# EAGLE design wireless_power_meter (EAGLE 6.1)
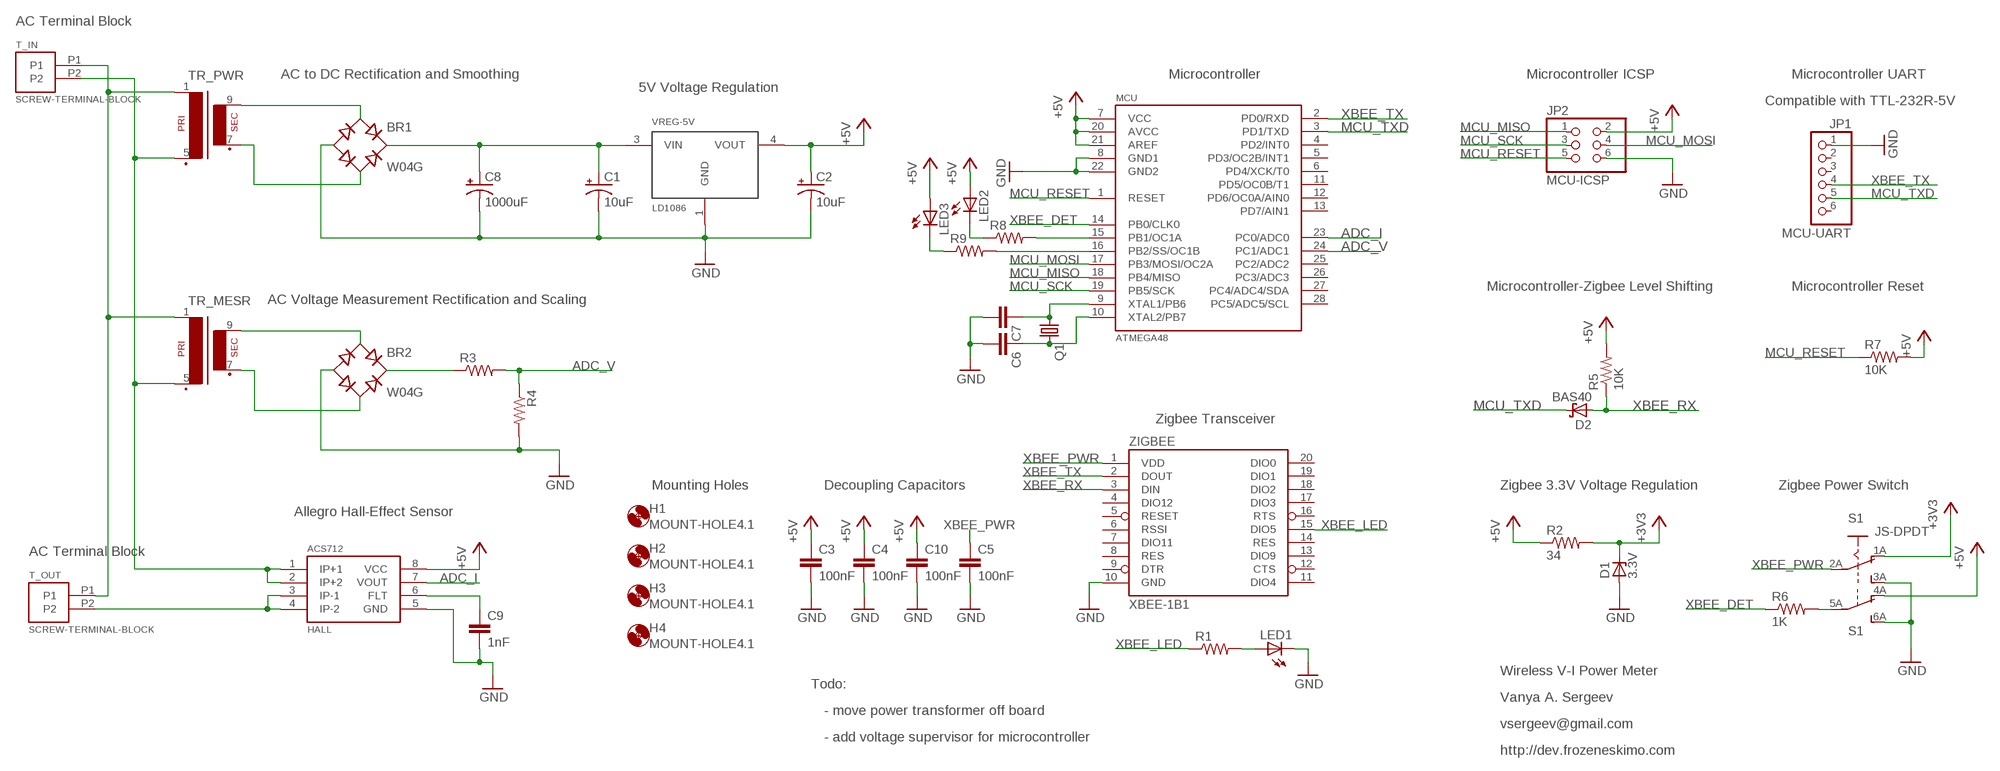
[diagram p0: schematic, sheet 1]

## Parts
BR1  W04G  [WOG]
BR2  W04G  [WOG]
C1  10uF  CPOL-USE2.5-5  [E2,5-5]
C2  10uF  CPOL-USE2.5-5  [E2,5-5]
C3  100nF  C-EUC0805  [C0805]
C4  100nF  C-EUC0805  [C0805]
C5  100nF  C-EUC0805  [C0805]
C6  C-EUC0805  [C0805]
C7  C-EUC0805  [C0805]
C8  1000uF  CPOL-USE5-13  [E5-13]
C9  1nF  C-EUC0805  [C0805]
C10  100nF  C-EUC0805  [C0805]
D1  3.3V  ZENER-DIODESOT23  [SOT23]
D2  BAS40  [SOT23]
H1  MOUNT-HOLE4.1  [4,1]
H2  MOUNT-HOLE4.1  [4,1]
H3  MOUNT-HOLE4.1  [4,1]
H4  MOUNT-HOLE4.1  [4,1]
HALL  ACS712  [SO8]
JP1  MCU-UART  PINHD-1X6  [1X06]
JP2  MCU-ICSP  PINHD-2X3  [2X03]
LED1  LEDCHIPLED_0805  [CHIPLED_0805]
LED2  LEDCHIPLED_0805  [CHIPLED_0805]
LED3  LEDCHIPLED_0805  [CHIPLED_0805]
MCU  ATMEGA48  [DIL28-3]
Q1  CRYSTALTC26H  [TC26H]
R1  R-US_R0805  [R0805]
R2  34  R-US_R0805  [R0805]
R3  R-US_R0805  [R0805]
R4  R-US_R0805  [R0805]
R5  10K  R-US_R0805  [R0805]
R6  1K  R-US_R0805  [R0805]
R7  10K  R-US_R0805  [R0805]
R8  R-US_R0805  [R0805]
R9  R-US_R0805  [R0805]
S1  JS-DPDT  [JS-MINI-SLIDE]
T_IN  SCREW-TERMINAL-BLOCK  [TERMINAL-BLOCK]
T_OUT  SCREW-TERMINAL-BLOCK  [TERMINAL-BLOCK]
TR_MESR  EI30-1  [EI30-1]
TR_PWR  EI30-1  [EI30-1]
VREG-5V  LD1086  [DPACK]
ZIGBEE  XBEE-1B1  [XBEE-1]

## Nets
+3V3: D1.3(C) R2.2 S1.1A(SW_UPPER:O)
+5V: C2.+ C3.1 C4.1 C10.1 HALL.8(VCC) JP2.2 LED2.A LED3.A MCU.7(VCC) MCU.20(AVCC) MCU.21(AREF) R2.1 R5.2 R7.2 S1.4A(SW_LOWER:O) VREG-5V.4(VOUT)
ADC_I: HALL.7(VOUT) MCU.23(PC0/ADC0)
ADC_V: MCU.24(PC1/ADC1) R3.2 R4.1
DC+: BR1.+ C1.+ C8.+ VREG-5V.3(VIN)
GND: BR1.- BR2.- C1.- C2.- C3.2 C4.2 C5.2 C6.2 C7.2 C8.- C9.2 C10.2 D1.1(A) HALL.5(GND) JP1.1 JP2.6 LED1.C MCU.8(GND1) MCU.22(GND2) R4.2 S1.3A(SW_UPPER:S) S1.6A(SW_LOWER:S) VREG-5V.1(GND) ZIGBEE.10(GND)
MCU_MISO: JP2.1 MCU.18(PB4/MISO)
MCU_MOSI: JP2.4 MCU.17(PB3/MOSI/OC2A)
MCU_RESET: JP2.5 MCU.1(RESET) R7.1
MCU_SCK: JP2.3 MCU.19(PB5/SCK)
MCU_TXD: D2.3(C) JP1.5 MCU.3(PD1/TXD)
N$2: BR1.AC1 TR_PWR.9(S4)
N$3: BR1.AC2 TR_PWR.7(S3)
N$4: C6.1 MCU.10(XTAL2/PB7) Q1.2
N$5: HALL.3(IP-1) HALL.4(IP-2) T_OUT.P2
N$6: BR2.AC1 TR_MESR.9(S4)
N$7: BR2.AC2 TR_MESR.7(S3)
N$9: BR2.+ R3.1
N$10: C9.1 HALL.6(FLT)
N$11: LED1.A R1.2
N$12: R6.2 S1.5A(SW_LOWER:P)
N$13: LED2.C R8.1
N$14: MCU.15(PB1/OC1A) R8.2
N$15: C7.1 MCU.9(XTAL1/PB6) Q1.1
N$16: MCU.16(PB2/SS/OC1B) R9.2
N$17: LED3.C R9.1
N$18: T_IN.P1 T_OUT.P1 TR_MESR.1 TR_PWR.1
N$20: HALL.1(IP+1) HALL.2(IP+2) T_IN.P2 TR_MESR.5(P2) TR_PWR.5(P2)
XBEE_DET: MCU.14(PB0/CLK0) R6.1
XBEE_LED: R1.1 ZIGBEE.15(DIO5)
XBEE_PWR: C5.1 S1.2A(SW_UPPER:P) ZIGBEE.1(VDD)
XBEE_RX: D2.1(A) R5.1 ZIGBEE.3(DIN)
XBEE_TX: JP1.4 MCU.2(PD0/RXD) ZIGBEE.2(DOUT)
Unconnected: JP1.2 JP1.3 JP1.6 MCU.4(PD2/INT0) MCU.5(PD3/OC2B/INT1) MCU.6(PD4/XCK/T0) MCU.11(PD5/OC0B/T1) MCU.12(PD6/OC0A/AIN0) MCU.13(PD7/AIN1) MCU.25(PC2/ADC2) MCU.26(PC3/ADC3) MCU.27(PC4/ADC4/SDA) MCU.28(PC5/ADC5/SCL) ZIGBEE.4(DIO12) ZIGBEE.5(RESET) ZIGBEE.6(RSSI) ZIGBEE.7(DIO11) ZIGBEE.8(RES) ZIGBEE.9(DTR) ZIGBEE.11(DIO4) ZIGBEE.12(CTS) ZIGBEE.13(DIO9) ZIGBEE.14(RES) ZIGBEE.16(RTS) ZIGBEE.17(DIO3) ZIGBEE.18(DIO2) ZIGBEE.19(DIO1) ZIGBEE.20(DIO0)

## Notes on the sheet
- AC Terminal Block
- AC to DC Rectification and Smoothing | Microcontroller | Microcontroller ICSP | Microcontroller UART
- 5V Voltage Regulation
- Compatible with TTL-232R-5V
- Microcontroller-Zigbee Level Shifting | Microcontroller Reset
- AC Voltage Measurement Rectification and Scaling
- Zigbee Transceiver
- Mounting Holes | Decoupling Capacitors | Zigbee 3.3V Voltage Regulation | Zigbee Power Switch
- Allegro Hall-Effect Sensor
- AC Terminal Block
- Wireless V-I Power Meter
- Todo:
- Vanya A. Sergeev
- - move power transformer off board
- vsergeev@gmail.com
- - add voltage supervisor for microcontroller
- http://dev.frozeneskimo.com

## Library data of the parts
BR1 BR2 = dbridge:W*G: Vishay/General Semiconductor W005G - W10G Bridge rectifier, 1.5A, 50 to 1000V
C1 C2 C8 = rcl:CPOL-US: POLARIZED CAPACITOR, American symbol
C3-C7 C9 C10 = rcl:C-EU: CAPACITOR, European symbol
D1 = diode:ZENER-DIODE: Z-Diode
D2 = diode:BAS40: Silicon Schottky Diodes General-purpose diode for high-speed switching
H1-H4 = holes:MOUNT-HOLE: MOUNTING HOLE with drill center marker
HALL = allegro-hall-effect:ACS712
JP1 = pinhead:PINHD-1X6: PIN HEADER
JP2 = pinhead:PINHD-2X3: PIN HEADER
LED1-LED3 = led:LED: LED OSRAM: - CHIPLED LG R971, LG N971, LY N971, LG Q971, LY Q971, LO R971, LY R971 LH N974, LH R974 LS Q976, LO Q976, LY Q976 LO Q996 - Hyper CHIPLED LW Q18S LB Q993, LB Q99A, LB R99A - SideLED LS A670, LO A670, LY A670, LG A670, LP A670 LB A673, LV A673, LT A673, LW A673 LH A674 LY A675 LS A676, LA A676, LO A676, LY A676, LW A676 LS A679, LY A679, LG A679 - Hyper Micro SIDELED® LS Y876, LA Y876, LO Y876, LY Y876 LT Y87S - SmartLED LW L88C, LW L88S LB L89C, LB L89S, LG L890 LS L89K, LO L89K, LY L89K LS L896, LA L896, LO L896, LY L896 - TOPLED LS T670, LO T670, LY T670, LG T670, LP T670 LSG T670, LSP T670, LSY T670, LOP T670, LYG T670 LG T671, LOG T671, LSG T671 LB T673, LV T673, LT T673, LW T673 LH T674 LS T676, LA T676, LO T676, LY T676, LB T676, LH T676, LSB T676, LW T676 LB T67C, LV T67C, LT T67C, LS T67K, LO T67K, LY T67K, LW E67C LS E67B, LA E67B, LO E67B, LY E67B, LB E67C, LV E67C, LT E67C LW T67C LS T679, LY T679, LG T679 LS T770, LO T770, LY T770, LG T770, LP T770 LB T773, LV T773, LT T773, LW T773 LH T774 LS E675, LA E675, LY E675, LS T675 LS T776, LA T776, LO T776, LY T776, LB T776 LHGB T686 LT T68C, LB T68C - Hyper Mini TOPLED® LB M676 - Mini TOPLED Santana® LG M470 LS M47K, LO M47K, LY M47K Source: http://www.osram.convergy.de LUXEON: - LUMILED® LXK2-PW12-R00, LXK2-PW12-S00, LXK2-PW14-U00, LXK2-PW14-V00 LXK2-PM12-R00, LXK2-PM12-S00, LXK2-PM14-U00 LXK2-PE12-Q00, LXK2-PE12-R00, LXK2-PE12-S00, LXK2-PE14-T00, LXK2-PE14-U00 LXK2-PB12-K00, LXK2-PB12-L00, LXK2-PB12-M00, LXK2-PB14-N00, LXK2-PB14-P00, LXK2-PB14-Q00 LXK2-PR12-L00, LXK2-PR12-M00, LXK2-PR14-Q00, LXK2-PR14-R00 LXK2-PD12-Q00, LXK2-PD12-R00, LXK2-PD12-S00 LXK2-PH12-R00, LXK2-PH12-S00 LXK2-PL12-P00, LXK2-PL12-Q00, LXK2-PL12-R00 Source: www.luxeon.com KINGBRIGHT: KA-3528ASYC Source: www.kingbright.com
MCU = atmel-newmicros:ATMEGA48
Q1 = crystal:CRYSTAL: CRYSTAL
R1-R9 = rcl:R-US_: RESISTOR, American symbol
S1 = custom-switch:JS-DPDT
T_IN T_OUT = custom-screw-terminal:SCREW-TERMINAL-BLOCK
TR_MESR TR_PWR = trafo:EI30-1: TRANSFORMER 1 primary winding, 1 secondary winding ERA
VREG-5V = st-vregs:LD1086
ZIGBEE = SparkFun:XBEE-1

## Board
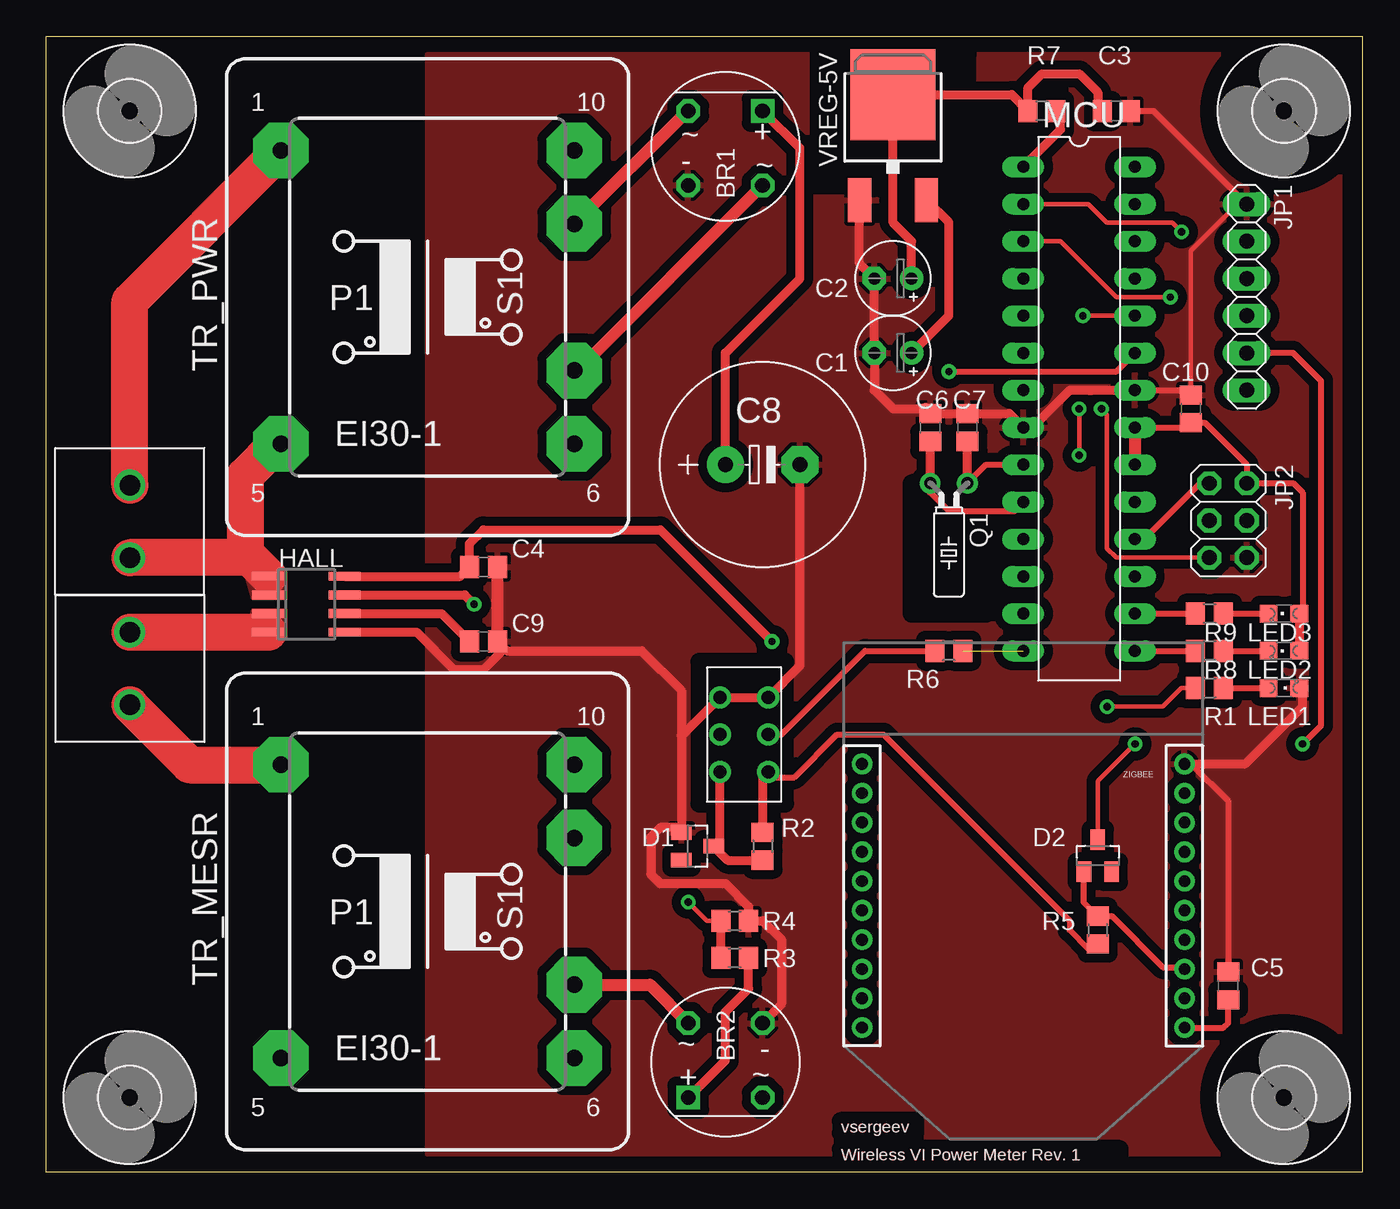
[diagram p1: board, top side]
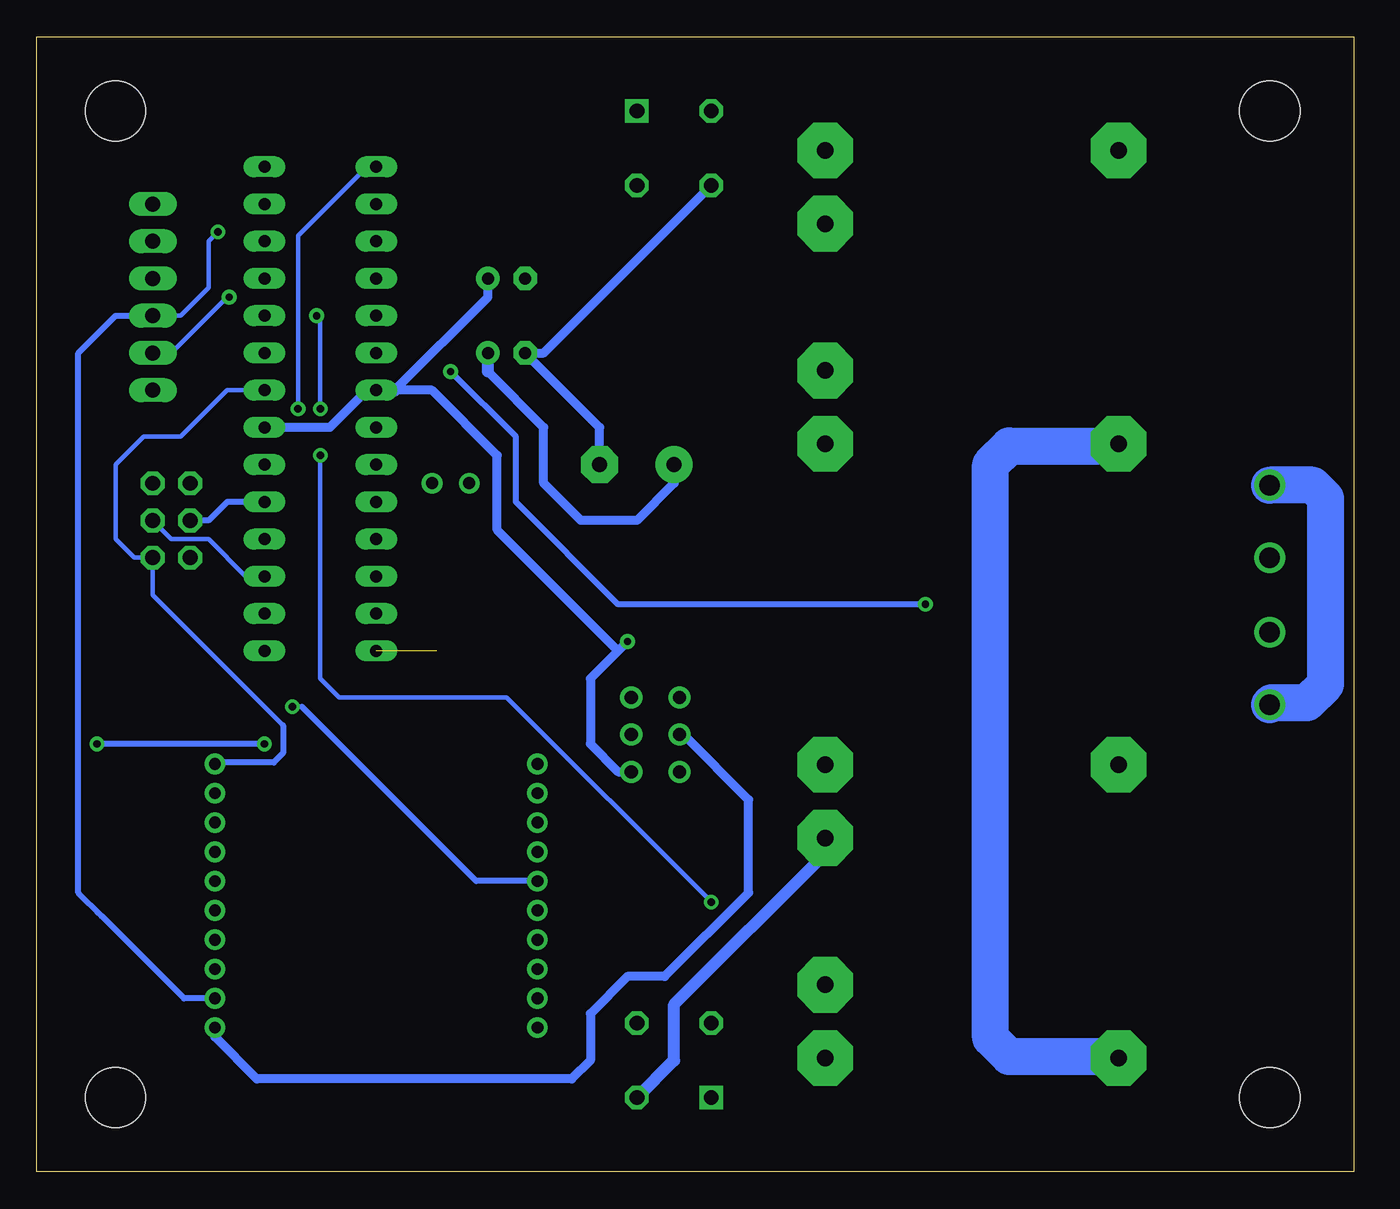
[diagram p2: board, bottom side, seen from below]

Size 89.84 x 77.46 mm. Coordinates in mm from the lower left corner, seen from the top.
Outline: 0,0 89.84,0 89.84,77.46 0,77.46 0,0
Copper layers (1*16): Top 0.0356mm / dielectric 1.5011mm / Bottom 0.0356mm
Design rules: minimum track width 8mil, minimum drill 19mil, track to track 8mil, track to pad 8mil, pad to pad 7mil, via to via 8mil, smd to smd 8mil, copper to edge 10mil, drill to drill 8mil, minimum pad ring 12mil, minimum via ring 10mil, stop-mask expansion 4mil, vias tented up to drill 25mil, thermal gap 10mil
tRestrict: area 52.7,67.3 to 62.9,76.2; area 59.1,38.1 to 64.1,47; area 44.6,25.1 to 50.4,34.8

### Footprints (pad centres in the part's own frame; a part is rotated, then mirrored left to right if it is on the bottom)
WOG = drill 1.016 square: + 2.54,2.54 | drill 1.016 octagon: - -2.54,-2.54; AC1 -2.54,2.54; AC2 2.54,-2.54
E2,5-5 = drill 0.813 pad 1.6: + -1.27,0 | drill 0.813 pad 1.6 octagon: - 1.27,0
C0805 = smd 1.3 x 1.5: 1 -0.95,0; 2 0.95,0
E5-13 = drill 1.016 pad 2.54: + -2.54,0 | drill 1.016 pad 2.54 octagon: - 2.54,0
SOT23 = smd 1 x 1.4: 1 -0.95,-1.1; 2 0.95,-1.1; 3 0,1.1
4,1 = hole 4.1: 0,0
SO8 = smd 0.6 x 2.2: 1 -1.905,-2.6; 2 -0.635,-2.6; 3 0.635,-2.6; 4 1.905,-2.6; 5 1.905,2.6; 6 0.635,2.6; 7 -0.635,2.6; 8 -1.905,2.6
1X06 = drill 1.016 long: 1 -6.35,0; 2 -3.81,0; 3 -1.27,0; 4 1.27,0; 5 3.81,0; 6 6.35,0
2X03 = drill 1.016 octagon: 1 -2.54,-1.27; 2 -2.54,1.27; 3 0,-1.27; 4 0,1.27; 5 2.54,-1.27; 6 2.54,1.27
CHIPLED_0805 = smd 1.2 x 1.2: A 0,-1.05; C 0,1.05
DIL28-3 = drill 0.813 long: 1 -16.51,-3.81; 2 -13.97,-3.81; 3 -11.43,-3.81; 4 -8.89,-3.81; 5 -6.35,-3.81; 6 -3.81,-3.81; 7 -1.27,-3.81; 8 1.27,-3.81; 9 3.81,-3.81; 10 6.35,-3.81; 11 8.89,-3.81; 12 11.43,-3.81; 13 13.97,-3.81; 14 16.51,-3.81; 15 16.51,3.81; 16 13.97,3.81; 17 11.43,3.81; 18 8.89,3.81; 19 6.35,3.81; 20 3.81,3.81; 21 1.27,3.81; 22 -1.27,3.81; 23 -3.81,3.81; 24 -6.35,3.81; 25 -8.89,3.81; 26 -11.43,3.81; 27 -13.97,3.81; 28 -16.51,3.81
TC26H = drill 0.813: 1 -1.27,0; 2 1.27,0
R0805 = smd 1.3 x 1.5: 1 -0.95,0; 2 0.95,0
JS-MINI-SLIDE = drill 0.9: 1A -2.54,1.651; 2A 0,1.651; 3A 2.54,1.651; 4A -2.54,-1.651; 5A 0,-1.651; 6A 2.54,-1.651
TERMINAL-BLOCK = drill 1.4: P1 -2.413,0; P2 2.54,0
EI30-1 = drill 1.118 pad 3.81 octagon: 1 -10.008,10.008; 5 -10.008,-10.008; 6 10.008,-10.008; 7 10.008,-5.004; 9 10.008,5.004; 10 10.008,10.008
DPACK = smd 1.6 x 3: 1 -2.28,-4.8; 3 2.28,-4.8 | smd 5.8 x 6.2: 4 0,2.38
XBEE-1 = drill 0.8: 1 -11,20; 2 -11,18; 3 -11,16; 4 -11,14; 5 -11,12; 6 -11,10; 7 -11,8; 8 -11,6; 9 -11,4; 10 -11,2; 11 11,2; 12 11,4; 13 11,6; 14 11,8; 15 11,10; 16 11,12; 17 11,14; 18 11,16; 19 11,18; 20 11,20

### Placement (x,y rotation side)
BR1  46.36,69.85 0 top
BR2  46.36,7.62 180 top
C1  57.79,55.88 180 top
C2  57.79,60.96 180 top
C3  73.02,72.39 0 top
C4  29.84,41.27 0 top
C5  80.64,12.7 90 top
C6  60.33,50.8 90 top
C7  62.87,50.8 90 top
C8  48.9,48.26 0 top
C9  29.84,36.2 0 top
C10  78.1,52.07 90 top
D1  44.45,22.23 270 top
D2  71.75,21.59 0 top
H1  84.45,5.08 0 top
H2  84.45,72.39 0 top
H3  5.71,72.39 0 top
H4  5.71,5.08 0 top
HALL  17.78,38.73 270 top
JP1  81.91,59.69 270 top
JP2  80.64,44.45 270 top
LED1  84.45,33.02 270 top
LED2  84.45,35.56 90 top
LED3  84.45,38.1 90 top
MCU  70.48,52.07 270 top
Q1  61.59,46.99 180 top
R1  79.38,33.02 0 top
R2  48.9,22.23 270 top
R3  46.99,14.61 180 top
R4  46.99,17.14 0 top
R5  71.75,16.51 270 top
R6  61.59,35.56 180 top
R7  67.94,72.39 180 top
R8  79.38,35.56 180 top
R9  79.38,38.1 180 top
S1  47.62,29.84 90 top
T_IN  5.71,44.45 270 top
T_OUT  5.71,34.29 90 top
TR_MESR  26.04,17.78 0 top
TR_PWR  26.04,59.69 0 top
VREG-5V  57.79,71.12 0 top
ZIGBEE  66.67,29.84 180 top

### Tracks (layer width: path | path; a pad name or v marks a point on that pad's centre or on a via)
+3V3
  Top 0.61: R2.2 46.5,21.28 D1.3 45.97,22.65 S1.1A
+5V  (via drill 0.5)
  Top 0.406: 48.9,26.92 51.05,26.92 53.98,29.84 57.15,29.84 69.85,17.14 69.85,16.51 71.12,15.24 71.43,15.24 R5.2 | MCU.21 77.78,50.8 arc90 C10.1 79.05,51.12 81.91,48.26 JP2.2 85.09,46.99 85.72,46.35 85.72,38.32 LED3.A
  Top 0.61: C2.+ 59.05,63.5 57.79,64.77 VREG-5V.4 65.88,73.5 R7.2 66.99,73.98 67.94,74.93 70.48,74.93 71.75,73.66 71.75,72.71 C3.1 | S1.4A 48.9,26.92 R2.1 | LED3.A LED2.A | HALL.8 28.26,40.64 C4.1 28.89,42.86 29.84,43.81 41.91,43.81 v49.53,36.2
  Top 0.813: MCU.21 MCU.20
  Bottom 0.61: C2.+ 59.05,59.69 65.41,53.34 62.87,53.34 58.42,48.89 58.42,43.81 50.16,35.56 | S1.4A 50.16,27.3 52.07,29.21 52.07,33.65 50.16,35.56 | v49.53,36.2 50.16,35.56 | MCU.7 67.31,53.34 69.85,50.8 MCU.21
  Bottom 0.813: 65.41,53.34 MCU.7
ADC_I  (via drill 0.5)
  Top 0.406: v61.59,54.61 73.02,54.61 MCU.23
  Top 0.61: HALL.7 28.57,39.37 v29.21,38.73
  Bottom 0.406: v29.21,38.73 50.16,38.73 57.15,45.72 57.15,50.16 v61.59,54.61
ADC_V  (via drill 0.5)
  Top 0.305: v70.48,48.89 v70.48,52.07 | v70.74,58.42 MCU.24 | R4.1 45.09,17.14 v43.82,18.41
  Top 0.61: R3.2 R4.1
  Bottom 0.305: v43.82,18.41 57.79,32.38 69.21,32.38 70.48,33.65 v70.48,48.89 | v70.48,52.07 70.48,58.17 v70.74,58.42
DC+
  Top 0.61: VREG-5V.3 61.59,64.79 61.59,58.42 C1.+ | BR1.+ 51.44,69.85 51.44,60.96 46.36,55.88 C8.+
  Bottom 0.61: 59.05,54.61 55.25,50.8 55.25,46.99 52.71,44.45 48.9,44.45 46.36,46.99 C8.+
  Bottom 0.813: 59.05,54.61 C1.+
GND
  Top 0.305: 85.72,32.8 arc90 LED1.C | C10.2 78.1,62.87 81.28,66.04 JP1.1
  Top 0.406: C5.2 80.64,25.3 78.1,27.84 ZIGBEE.10 | C3.2 75.56,72.39 JP1.1 | C10.2 77.78,53.34 MCU.22
  Top 0.61: VREG-5V.1 55.51,61.97 C2.- C1.- 56.52,53.34 57.79,52.07 60.01,52.07 | C6.2 C7.2 65.72,51.75 MCU.8 67.31,50.8 69.85,53.34 MCU.22 | 43.35,29.76 S1.3A S1.6A 51.44,34.54 C8.- | 43.35,29.76 D1.1 43.03,23.5 41.91,23.5 41.27,22.86 41.27,20.32 41.91,19.68 46.36,19.68 47.94,18.1 R4.2 | BR2.- 50.16,11.43 50.16,15.88 48.9,17.14 R4.2 | R4.2 48.26,17.14 | LED1.C 85.72,32.8 85.72,31.75 81.82,27.84 ZIGBEE.10 | 30.79,36.83 31.11,36.51 31.11,35.56 29.84,34.29 27.81,34.29 25.27,36.83 HALL.5 | 43.35,29.76 43.35,32.85 40.64,35.56 31.43,35.56 C9.2
  Top 0.813: C9.2 30.79,36.83 C4.2 | 60.01,52.07 C6.2
  Bottom 0.305: MCU.22 76.83,53.34 80.01,50.16 82.55,50.16 84.45,48.26 84.45,43.18 83.18,41.91 JP2.6 81.91,39.37 73.02,30.48
  Bottom 0.406: 73.02,30.48 73.02,28.57 73.66,27.94 77.58,27.94 ZIGBEE.10
  Bottom 0.61: BR1.- 55.25,55.88 C1.- 51.44,50.8 C8.-
  pour Top (isolate 0.61): 88.27,1.27 88.27,76.2 26.04,76.2 26.04,1.27
MCU_MISO
  Top 0.406: JP2.1 78.74,46.99 74.93,43.18 MCU.18
MCU_MOSI
  Bottom 0.305: MCU.17 75.56,40.64 78.1,43.18 80.64,43.18 JP2.4
MCU_RESET  (via drill 0.5)
  Top 0.305: JP2.5 73.02,41.91 72.39,42.54 72.39,51.69 v72.01,52.07
  Top 0.61: MCU.1 69.21,71.12 69.21,72.07 R7.1
  Bottom 0.305: MCU.1 67.31,68.58 72.01,63.88 v72.01,52.07
MCU_SCK
  Bottom 0.406: MCU.19 76.83,45.72 78.1,44.45 JP2.3
MCU_TXD  (via drill 0.5)
  Top 0.305: MCU.3 69.21,63.5 73.02,59.69 v76.71,59.69 | D2.3 71.75,26.67 v74.3,29.21
  Top 0.406: JP1.5 85.09,55.88 86.99,53.97 86.99,30.48 v85.72,29.21
  Bottom 0.305: JP1.5 80.64,55.88 76.83,59.69 v76.71,59.69
  Bottom 0.406: v74.3,29.21 v85.72,29.21
N$2
  Top 0.813: TR_PWR.9 43.74,72.39 BR1.AC1
N$3
  Top 0.813: TR_PWR.7 36.27,54.69 BR1.AC2
N$4
  Top 0.406: MCU.10 66.04,45.08 61.59,45.08 60.33,46.35 Q1.2
  Top 0.61: Q1.2 C6.1
N$5
  Top 0.254: HALL.4 HALL.3
  Top 2.54: T_OUT.P2 HALL.4
  pour Top (no thermals): 16.38,38.35 16.38,36.58 13.59,36.58 14.1,38.35
N$6
  Bottom 0.813: TR_MESR.9 36.04,21.74 46.36,11.43 46.36,7.62 BR2.AC1
N$7
  Top 0.813: TR_MESR.7 41.2,12.78 BR2.AC2
N$9
  Top 0.61: BR2.+ 46.36,7.62 46.36,10.92 47.94,12.51 R3.1
N$10
  Top 0.61: HALL.6 26.99,38.1 C9.1
N$11
  Top 0.406: R1.2 LED1.A
N$12
  Top 0.406: 60.33,35.56 55.88,35.56 50.16,29.84 S1.5A
  Top 0.61: 60.33,35.56 R6.2
N$13
  Top 0.406: R8.1 LED2.C
N$14
  Top 0.406: MCU.15 R8.2
N$15
  Top 0.406: Q1.1 64.13,48.26 MCU.9
  Top 0.61: Q1.1 C7.1
N$16
  Top 0.406: MCU.16 R9.2
N$17
  Top 0.406: R9.1 LED3.C
N$18
  Top 2.54: T_IN.P1 5.71,59.38 TR_PWR.1 | T_OUT.P1 9.8,27.79 TR_MESR.1
  Bottom 2.54: T_IN.P1 2.79,46.86 1.91,45.97 1.91,33.27 3.17,32 5.59,32 T_OUT.P1
N$20
  Top 0.254: HALL.1 HALL.2
  Top 2.54: T_IN.P2 13.91,41.91 HALL.1 13.59,42.23 13.59,47.5 15.77,49.68 TR_PWR.5
  Bottom 2.54: TR_PWR.5 16.18,49.53 23.49,49.53 24.76,48.26 24.76,9.14 23.49,7.87 16.13,7.87 TR_MESR.5
  pour Top (no thermals): 16.38,39.12 16.38,40.89 13.59,40.89 14.1,39.12
XBEE_DET  (1 unrouted)
XBEE_LED  (via drill 0.5)
  Top 0.305: v72.39,31.75 76.2,31.75 77.47,33.02 R1.1
  Bottom 0.305: 71.75,31.75 v72.39,31.75
  Bottom 0.406: 71.75,31.75 59.85,19.84 ZIGBEE.15
XBEE_PWR
  Top 0.406: C5.1 80.64,10.16 80.33,9.85 ZIGBEE.1
  Bottom 0.61: S1.2A 45.72,29.84 41.27,25.4 41.27,19.05 46.99,13.34 49.53,13.34 52.07,10.79 52.07,7.62 53.34,6.35 74.81,6.35 77.67,9.21 ZIGBEE.1
XBEE_RX
  Top 0.406: D2.1 70.8,18.41 R5.1 72.71,17.46 76.2,13.97 77.55,13.97 ZIGBEE.3
XBEE_TX  (via drill 0.5)
  Top 0.305: MCU.2 71.12,66.04 72.39,64.77 76.83,64.77 v77.47,64.14
  Bottom 0.305: v77.47,64.14 78.1,63.5 78.1,60.32 80.01,58.42 JP1.4
  Bottom 0.406: JP1.4 84.45,58.42 86.99,55.88 86.99,19.05 85.41,17.46 | 85.41,17.46 85.72,17.78 | 85.41,17.46 79.79,11.85 ZIGBEE.2

### Text on the board
Top: vsergeev | Wireless VI Power Meter Rev. 1
tNames: vsergeev | Wireless VI Power Meter Rev. 1